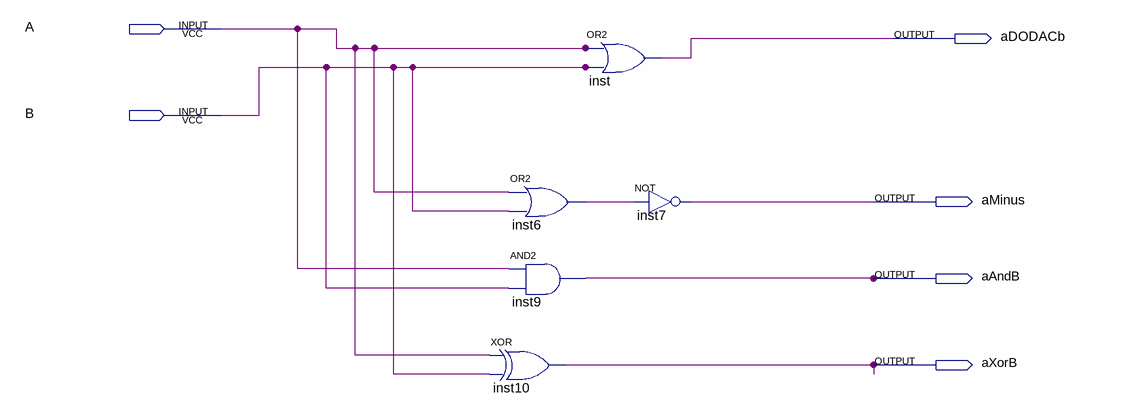
[diagram p0: schematic sheet]
// Quartus schematic zadania.bdf as structural Verilog: 5 symbols, 6 pins
module zadania (
  input  A,
  input  B,
  output aDODACb,
  output aMinus,
  output aAndB,
  output aXorB
);

  wire inst6_out;

  xor inst10 (aXorB, A, B);
  or inst6 (inst6_out, A, B);
  and inst9 (aAndB, A, B);
  or inst (aDODACb, A, B);
  not inst7 (aMinus, inst6_out);
endmodule
